# Altium project SMT_PCB.PrjPcb
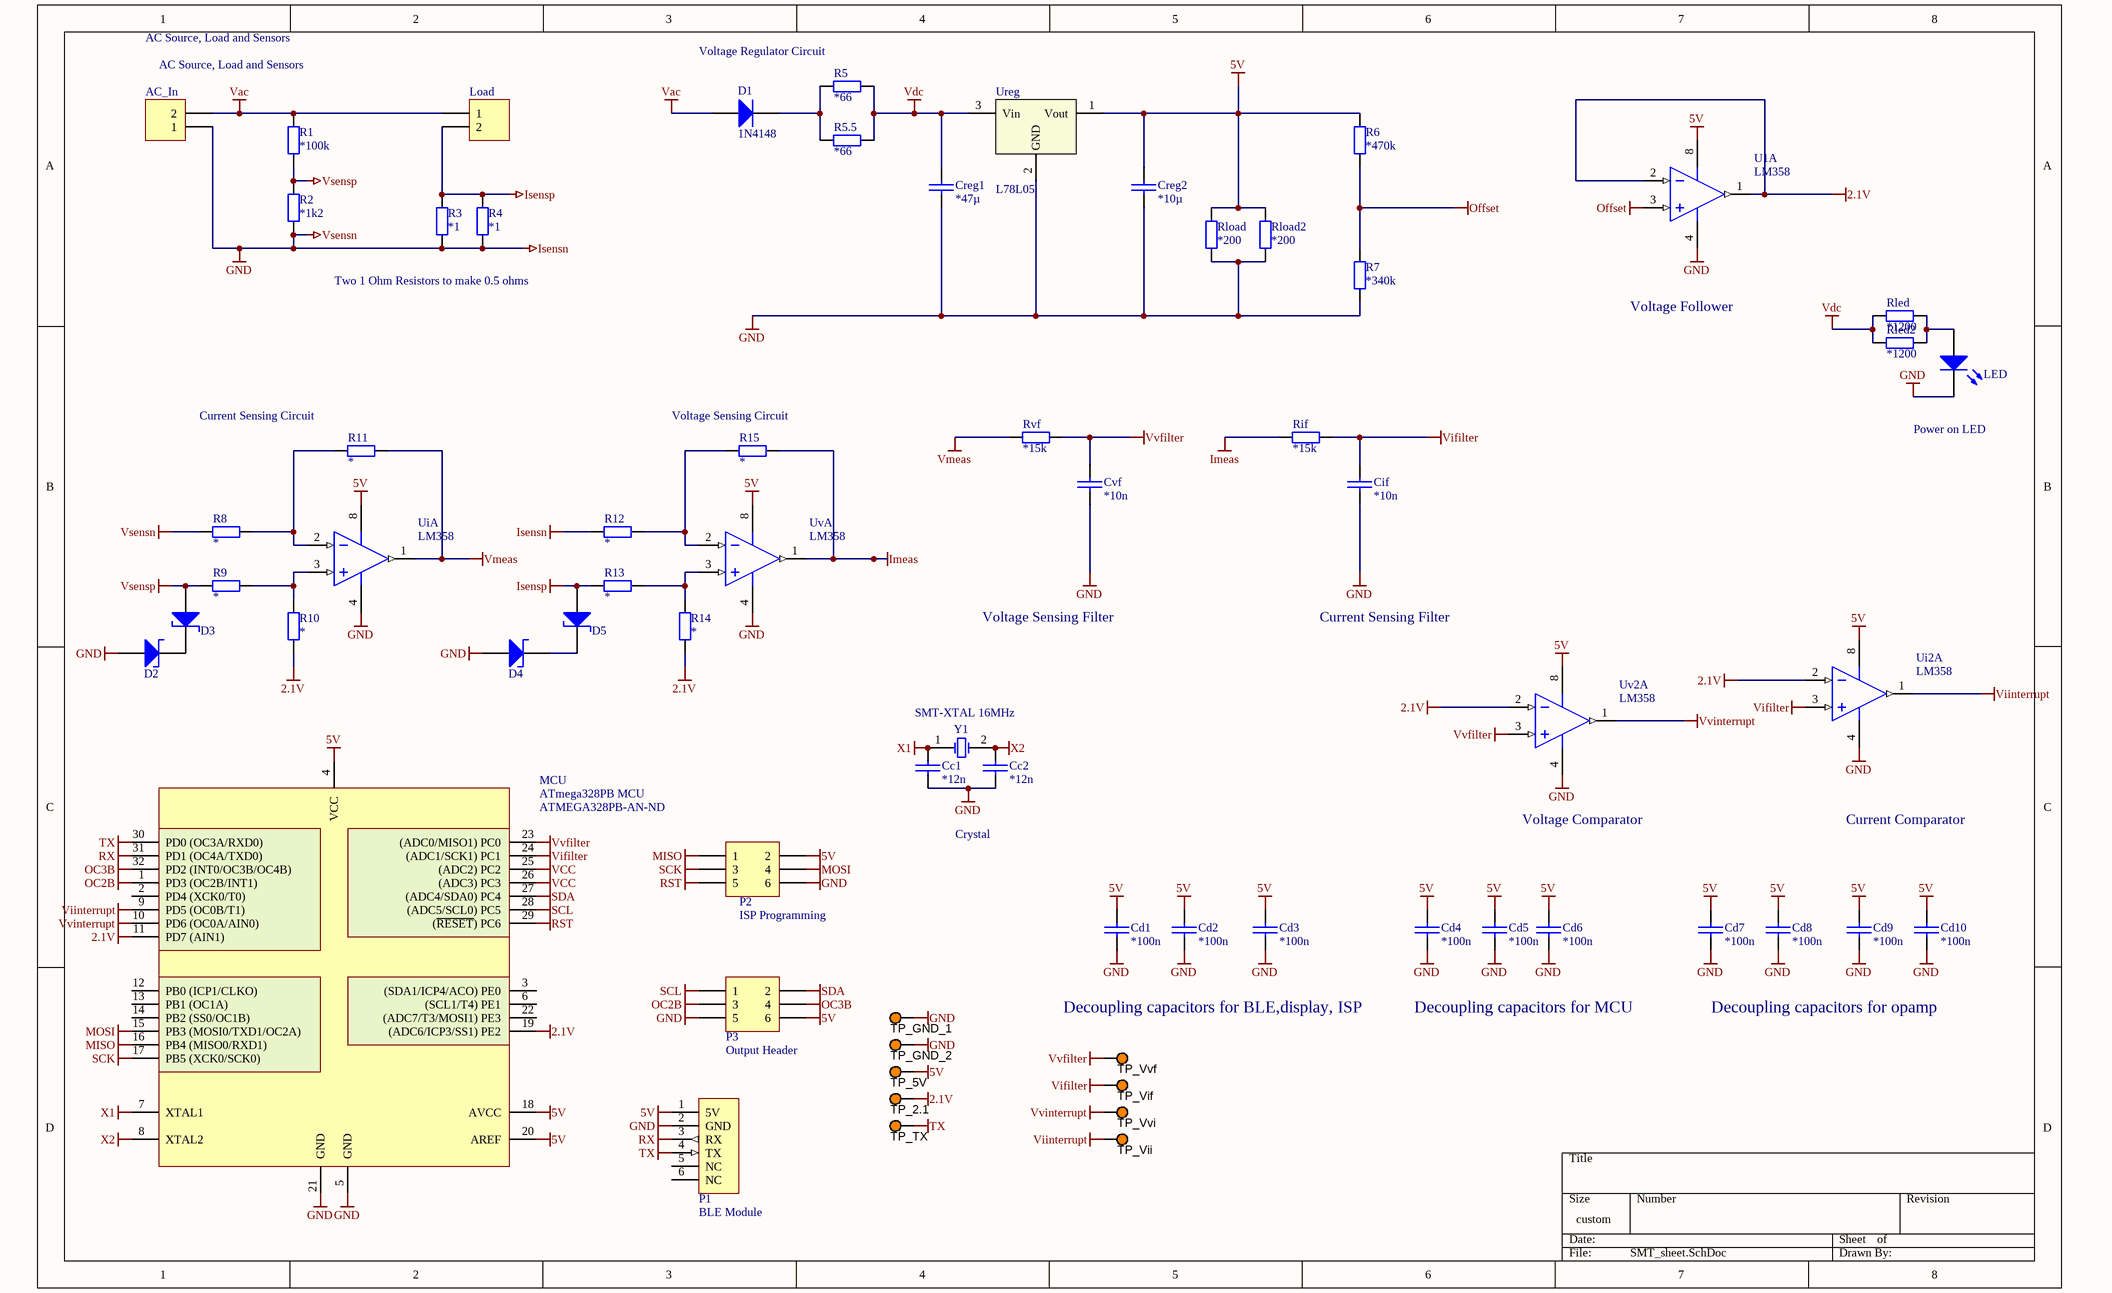
[diagram p0: SMT_sheet.SchDoc]
1 sheet, 66 parts. Net scope: global (net labels, ports and power ports of the same name join across sheets).
Board file: PCB1.PcbDoc

## Sheet SMT_sheet.SchDoc
size 381 x 241 mm; SheetNumber: 1; SheetTotal: 1

### Parts
AC_In  Header 2  [ece-HDR1X2]  (value not drawn)
Cc1  *12n  [0805 CAP]
Cc2  *12n  [0805 CAP]
Cd1  *100n  [0805 CAP]
Cd2  *100n  [0805 CAP]
Cd3  *100n  [0805 CAP]
Cd4  *100n  [0805 CAP]
Cd5  *100n  [0805 CAP]
Cd6  *100n  [0805 CAP]
Cd7  *100n  [0805 CAP]
Cd8  *100n  [0805 CAP]
Cd9  *100n  [0805 CAP]
Cd10  *100n  [0805 CAP]
Cif  *10n  [0805 CAP]
Creg1  *47µ  [0805 CAP]
Creg2  *10µ  [0805 CAP]
Cvf  *10n  [0805 CAP]
D1  1N4148  [DO214-MFG]
D2  BZT52H-B4V7  [SOD123]  (value not drawn)
D3  BZT52H-B4V7  [SOD123]  (value not drawn)
D4  BZT52H-B4V7  [SOD123]  (value not drawn)
D5  BZT52H-B4V7  [SOD123]  (value not drawn)
LED  LTST-C170KGKT  [0805 LED]  (value not drawn)
Load  Header 2  [ece-HDR1X2]  (value not drawn)
MCU  ATmega328PB MCU  Supplier Part Number 1: ATMEGA328PB-AN-ND  [32 - TQFP]
P1  BLE Module Header  [HM10_HDR1X6]  (value not drawn)
P2  Header 3X2  [ECE-BHDR2X3]  (value not drawn)
P3  Header 3X2  [ECE-BHDR2X3]  (value not drawn)
R1  *100k  [0805 RES]
R2  *1k2  [0805 RES]
R3  *1  [0805 RES]
R4  *1  [0805 RES]
R5  *66  [0805 RES]
R5.5  *66  [0805 RES]
R6  *470k  [0805 RES]
R7  *340k  [0805 RES]
R8  *  [0805 RES]
R9  *  [0805 RES]
R10  *  [0805 RES]
R11  *  [0805 RES]
R12  *  [0805 RES]
R13  *  [0805 RES]
R14  *  [0805 RES]
R15  *  [0805 RES]
Rif  *15k  [0805 RES]
Rled  *1200  [0805 RES]
Rled2  *1200  [0805 RES]
Rload  *200  [0805 RES]
Rload2  *200  [0805 RES]
Rvf  *15k  [0805 RES]
TP_2.1  5003  [TP_TH]  (value not drawn)
TP_5V  5003  [TP_TH]  (value not drawn)
TP_GND_1  5003  [TP_TH]  (value not drawn)
TP_GND_2  5003  [TP_TH]  (value not drawn)
TP_TX  5003  [TP_TH]  (value not drawn)
TP_Vif  5003  [TP_TH]  (value not drawn)
TP_Vii  5003  [TP_TH]  (value not drawn)
TP_Vvf  5003  [TP_TH]  (value not drawn)
TP_Vvi  5003  [TP_TH]  (value not drawn)
U1  LM358  [SO - 8]  (part A of 2)
Ui  LM358  [SO - 8]  (part A of 2)
Ui2  LM358  [SO - 8]  (part A of 2)
Ureg  L78L05  [SOT-89]
Uv  LM358  [SO - 8]  (part A of 2)
Uv2  LM358  [SO - 8]  (part A of 2)
Y1  SMT-XTAL 16MHz  [HC49-US]

### Nets
2.1V: MCU.11(PD7_(AIN1)) MCU.19((ADC6/ICP3/SS1)_PE2) R10.1 R14.1 TP_2.1.1 U1.1(VOUTA) U1.2(VINA-) Ui2.2(VINA-) Uv2.2(VINA-)
5V: Cd1.1 Cd2.1 Cd3.1 Cd4.1 Cd5.1 Cd6.1 Cd7.1 Cd8.1 Cd9.1 Cd10.1 Creg2.1 MCU.4(VCC) MCU.18(AVCC) MCU.20(AREF) P1.1(5V) P2.2 P3.6 R6.2 Rload.2 Rload2.2 TP_5V.1 U1.8(VDD) Ui.8(VDD) Ui2.8(VDD) Ureg.1(Vout) Uv.8(VDD) Uv2.8(VDD)
GND: AC_In.1 Cc1.2 Cc2.2 Cd1.2 Cd2.2 Cd3.2 Cd4.2 Cd5.2 Cd6.2 Cd7.2 Cd8.2 Cd9.2 Cd10.2 Cif.2 Creg1.2 Creg2.2 Cvf.2 D2.1(A) D4.1(A) LED.2(K) MCU.5(GND) MCU.21(GND) P1.2(GND) P2.6 P3.5 R2.1 R3.1 R4.1 R7.1 R8.1 R12.1 Rload.1 Rload2.1 TP_GND_1.1 TP_GND_2.1 U1.4(VSS) Ui.4(VSS) Ui2.4(VSS) Ureg.2(GND) Uv.4(VSS) Uv2.4(VSS)  [also labelled Isensn, Vsensn]
Imeas: R15.2 Rif.1 Uv.1(VOUTA)
Isensp: D5.1(A) Load.2 R3.2 R4.2 R13.1
MISO: MCU.16(PB4_(MISO0/RXD1)) P2.1
MOSI: MCU.15(PB3_(MOSI0/TXD1/OC2A)) P2.4
OC2B: MCU.1(PD3_(OC2B/INT1)) P3.3
OC3B: MCU.32(PD2_(INT0/OC3B/OC4B)) P3.4
Offset: R6.1 R7.2 U1.3(VINA+)
RST: MCU.29((~{RESET})_PC6) P2.5
RX: MCU.31(PD1_(OC4A/TXD0)) P1.3(RX)
SCK: MCU.17(PB5_(XCK0/SCK0)) P2.3
SCL: MCU.28((ADC5/SCL0)_PC5) P3.1
SDA: MCU.27((ADC4/SDA0)_PC4) P3.2
TX: MCU.30(PD0_(OC3A/RXD0)) P1.4(TX) TP_TX.1
Vac: AC_In.2 D1.1(A) Load.1 R1.2
VCC: MCU.25((ADC2)_PC2) MCU.26((ADC3)_PC3)
Vdc: Creg1.1 R5.2 R5.5.2 Rled.1 Rled2.1 Ureg.3(Vin)
Vifilter: Cif.1 MCU.24((ADC1/SCK1)_PC1) Rif.2 TP_Vif.1 Ui2.3(VINA+)
Viinterrupt: MCU.9(PD5_(OC0B/T1)) TP_Vii.1 Ui2.1(VOUTA)
Vmeas: R11.2 Rvf.1 Ui.1(VOUTA)
Vsensp: D3.1(A) R1.1 R2.2 R9.1
Vvfilter: Cvf.1 MCU.23((ADC0/MISO1)_PC0) Rvf.2 TP_Vvf.1 Uv2.3(VINA+)
Vvinterrupt: MCU.10(PD6_(OC0A/AIN0)) TP_Vvi.1 Uv2.1(VOUTA)
X1: Cc1.1 MCU.7(XTAL1) Y1.1(OSC1)
X2: Cc2.1 MCU.8(XTAL2) Y1.2(OSC2)
NetD1_2: D1.2(K) R5.1 R5.5.1
NetD2_2: D2.2(K) D3.2(K)
NetD4_2: D4.2(K) D5.2(K)
NetLED_1: LED.1(A) Rled.2 Rled2.2
NetR8_2: R8.2 R11.1 Ui.2(VINA-)
NetR9_2: R9.2 R10.2 Ui.3(VINA+)
NetR12_2: R12.2 R15.1 Uv.2(VINA-)
NetR13_2: R13.2 R14.2 Uv.3(VINA+)

Not connected (* = marked no-connect by the designer): MCU 2(PD4_(XCK0/T0)) 3((SDA1/ICP4/ACO)_PE0) 6((SCL1/T4)_PE1) 12(PB0_(ICP1/CLKO)) 13(PB1_(OC1A)) 14(PB2_(SS0/OC1B)) 22((ADC7/T3/MOSI1)_PE3); P1 5(NC) 6(NC)

### Notes on the sheet
- AC Source, Load and Sensors
- (near R5) Voltage Regulator Circuit
- Two 1 Ohm Resistors to make 0.5 ohms
- Voltage Follower
- (near R11) Current Sensing Circuit
- (near R15) Voltage Sensing Circuit
- Power on LED
- Voltage Sensing Filter
- Current Sensing Filter
- Crystal
- Voltage Comparator
- Current Comparator
- (near P2) ISP Programming
- Decoupling capacitors for BLE,display, ISP
- Decoupling capacitors for MCU
- Decoupling capacitors for opamp
- (near P3) Output Header
- (near P1) BLE Module

### Library data of the parts
AC_In Load = Header 2: Header, 2-Pin; LatestRevisionDate: 17-Jul-2002; LatestRevisionNote: Re-released for DXP Platform.; Publisher: Altium Limited
Cc1 Cc2 Cd1-Cd10 Cif Creg1 Creg2 Cvf = CerCap_SMT_0805: SMT ceramic capacitor 0805 size
  Cc1 Cc2: Value: *12n
  Cd1-Cd10: Value: *100n
  Cif Cvf: Value: *10n
  Creg1: Value: *47µ
  Creg2: Value: *10µ
D1 = ES1H_SMT_DO214: 1N4148 100V 200mA SOD-123 diode; Manufacturer: ON Semiconductor; Manufacturer Part Number: 1N4148TR; Diode Type: Standard; Speed: Small Signal =< 200mA (Io), Any Speed; Capacitance @ Vr, F: 4pF @ 0V, 1MHz; Supplier 1: Digi-Key; RoHS: RoHS Compliant; Category: Discrete Semiconductor Products; Stock 1: 1658049; Pricing 1: 1=0.16, 10=0.109, 100=0.0592, 500=0.03648, 1000=0.02488 (NZD); Part Status: Active; Current - Average Rectified (Io): 200mA; Mounting Type: Through Hole; Package / Case: DO-204AH, DO-35, Axial; Supplier Device Package: DO-35; Operating Temperature - Junction: -65°C ~ 175°C; Base Part Number: 1N4148; ComponentLink1URL: https://www.fairchildsemi.com/datasheets/1N/1N914.pdf; ComponentLink1Description: https://www.fairchildsemi.com/datasheets/1N/1N914.pdf; Supplier Part Number 1: 1N4148FSCT-ND
D2-D5 = Zener_SMT_SOD123: SMT zener diode with SOD123 package; Manufacturer: Nexperia USA Inc.; Manufacturer Part Number: BZT52H-B4V7,115; Tolerance: ±2%; Supplier 1: Digi-Key; RoHS: RoHS Compliant; Category: Discrete Semiconductor Products; Stock 1: 0; Pricing 1: 1=0.51, 10=0.408, 100=0.2164, 500=0.14232, 1000=0.09678 (NZD); Packaging: Cut Tape (CT); Part Status: Active; Operating Temperature: -65°C ~ 150°C (TA); Mounting Type: Surface Mount; Package / Case: SOD-123F; Supplier Device Package: SOD-123F; ComponentLink1URL: https://assets.nexperia.com/documents/data-sheet/BZT52H_SER.pdf; ComponentLink1Description: https://assets.nexperia.com/documents/data-sheet/BZT52H_SER.pdf; Supplier Part Number 1: 1727-1611-1-ND
LED = LED_SMT_0805: SMT LED 0805 size; Manufacturer: Lite-On Inc.; Lens Color: Colorless; Lens Transparency: Clear; Millicandela Rating: 35mcd; Lens Style/Size: Rectangle with Flat Top, 1.40mm x 1.25mm; Voltage - Forward (Vf) (Typ): 2V; Current - Test: 20mA; Viewing Angle: 130°; Wavelength - Dominant: 571nm; Wavelength - Peak: 574nm; Supplier 1: Digi-Key; Manufacturer Part Number: LTST-C170KGKT; RoHS: RoHS Compliant; Category: Optoelectronics; Stock 1: 503069; Pricing 1: 1=0.62, 10=0.459, 25=0.338, 100=0.2415, 250=0.16416, 500=0.14486, 1000=0.11347 (NZD); Packaging: Cut Tape (CT); Part Status: Active; Color: Green; Mounting Type: Surface Mount; Features: -; Package / Case: 0805 (2012 Metric); Size / Dimension: 2.00mm L x 1.25mm W; Height (Max): 1.10mm; ComponentLink1URL: http://optoelectronics.liteon.com/upload/download/DS22-2000-073/LTST-C170KGKT.pdf; ComponentLink1Description: http://optoelectronics.liteon.com/upload/download/DS22-2000-073/LTST-C170KGKT.pdf; Supplier Part Number 1: 160-1414-1-ND
MCU = ATmega328PB_SMT_TQFP32: IC MCU 8BIT 32KB FLASH 32TQFP; Manufacturer: Atmel; Manufacturer Part Number: ATMEGA328PB-AN; Core Processor: AVR; Core Size: 8-Bit; Speed: 20MHz; Connectivity: I²C, SPI, UART/USART; Peripherals: Brown-out Detect/Reset, POR, PWM, WDT; Number of I/O: 27; Program Memory Size: 32KB (16K x 16); EEPROM Size: 1K x 8; RAM Size: 2K x 8; Voltage - Supply (Vcc/Vdd): 1.8 V ~ 5.5 V; Data Converters: A/D 8x10b; Oscillator Type: Internal; Supplier 1: Digi-Key; RoHS: RoHS Compliant; Category: Integrated Circuits (ICs); Stock 1: 366; Pricing 1: 1=2.74, 10=2.448, 25=2.2032, 100=2.0074, 250=1.81152, 500=1.62548, 1000=1.37088 (USD); Packaging: Tray; Part Status: Active; Program Memory Type: FLASH; Operating Temperature: -40°C ~ 105°C (TA); Package / Case: 32-TQFP; Supplier Device Package: 32-TQFP (7x7); ComponentLink1URL: http://www.atmel.com/images/atmel-42397-8-bit-avr-microcontroller-atmega328pb_datasheet.pdf; ComponentLink1Description: http://www.atmel.com/images/atmel-42397-8-bit-avr-microcontroller-atmega328pb_datasheet.pdf
P1 = BLEModule_TH: 2.54mm pitch 6-pin header for BLE module; LatestRevisionDate: 17-Jul-2002; LatestRevisionNote: Re-released for DXP Platform.; Publisher: Altium Limited
R1-R5 R5.5 R6-R15 Rif Rled Rled2 Rload Rload2 Rvf = Res_SMT_0805: 0805 resistor; Published: 8-Jun-2000; LatestRevisionDate: 17-Jul-2002; LatestRevisionNote: Re-released for DXP Platform.; PackageReference: AXIAL-0.4; Publisher: Altium Limited; ComponentLink1Description: https://nz.mouser.com/datasheet/2/315/AOA0000C304-1149620.pdf
  R1: Value: *100k
  R2: Value: *1k2
  R3 R4: Value: *1
  R5 R5.5: Value: *66
  R6: Value: *470k
  R7: Value: *340k
  R8-R15: Value: *
  Rif Rvf: Value: *15k
  Rled Rled2: Value: *1200
  Rload Rload2: Value: *200
TP_2.1 TP_5V TP_GND_1 TP_GND_2 TP_TX TP_Vif TP_Vii TP_Vvf TP_Vvi = TestPoint: Test Point, Orange, 1-Pin THD, RoHS; Peak Reverse Current: 600 uA; Forward Current: 3 A; Max Surge Current: 80 A; Forward Voltage: 1.08 V; Max Operating Temperature: 150 degC; PackageReference: 5003; Pins: 2; ComponentLink2URL: http://keyelco.com/userAssets/file/M65p56.pdf; PackageDescription: 1-Pin Through Hole Device, Dia 2.54 mm; Weight: 0.01 lb; Diameter: 5.3 mm; Mount: Through Hole; Package Quantity: 500; Packaging: Bulk; Min Operating Temperature: -65 degC; ComponentLink1Description: Manufacturer URL; Height: 0.25 inch; ComponentLink1URL: http://www.keyelco.com/; ComponentLink2Description: Datasheet; Width: 0.25 inch; REACH SVHC: No SVHC; RoHSCompliant: true; Radiation Hardening: No; Length: 9.5 mm; DatasheetVersion: Jun-15
U1 Ui Ui2 Uv Uv2 = LM358_SMT_SOIC8: IC OPAMP 8SOIC; ComponentLink1URL: http://www.ti.com/lit/ds/symlink/tlc080a.pdf; ComponentLink1Description: http://www.ti.com/lit/ds/symlink/tlc080a.pdf; Supplier 1: Digi-Key; Supplier Part Number 1: 296-1014-1-ND
Ureg = L78L05_SMT_SOT89: LDO Voltage Regulator 5V; ComponentLink1URL: http://www.st.com/content/ccc/resource/technical/document/datasheet/99/3b/7d/91/91/51/4b/be/CD00000544.pdf/files/CD00000544.pdf/jcr:content/translations/en.CD00000544.pdf; ComponentLink1Description: http://www.st.com/content/ccc/resource/technical/document/datasheet/99/3b/7d/91/91/51/4b/be/CD00000544.pdf/files/CD00000544.pdf/jcr:content/translations/en.CD00000544.pdf; Supplier 1: Digi-Key; Supplier Part Number 1: 497-1181-1-ND
Y1 = TXC9C-16_XTAL_SMT: 9C-16.000MAAJ-T crystal 16.0000MHZ 18PF SMD; Manufacturer: TXC CORPORATION; Frequency Stability: ±30ppm; Operating Mode: Fundamental; Supplier 1: Digi-Key; Manufacturer Part Number: 9C-16.000MAAJ-T; RoHS: RoHS Compliant; Category: Crystals, Oscillators, Resonators; Stock 1: 11514; Pricing 1: 1=0.75, 10=0.628, 50=0.5656, 100=0.5026, 500=0.47744 (NZD); Packaging: Cut Tape (CT); Part Status: Active; Type: MHz Crystal; Frequency Tolerance: ±30ppm; Load Capacitance: 18pF; Operating Temperature: -20°C ~ 70°C; Ratings: -; Mounting Type: Surface Mount; Package / Case: HC-49/US; Size / Dimension: 0.449" L x 0.189" W (11.40mm x 4.80mm); Height - Seated (Max): 0.161" (4.10mm); ComponentLink1URL: http://www.txccorp.com/download/products/quartz_crystals/2015TXC_9C_32.pdf; ComponentLink1Description: http://www.txccorp.com/download/products/quartz_crystals/2015TXC_9C_32.pdf; Supplier Part Number 1: 887-1059-1-ND